# Altium project Vitrine.PrjPcb
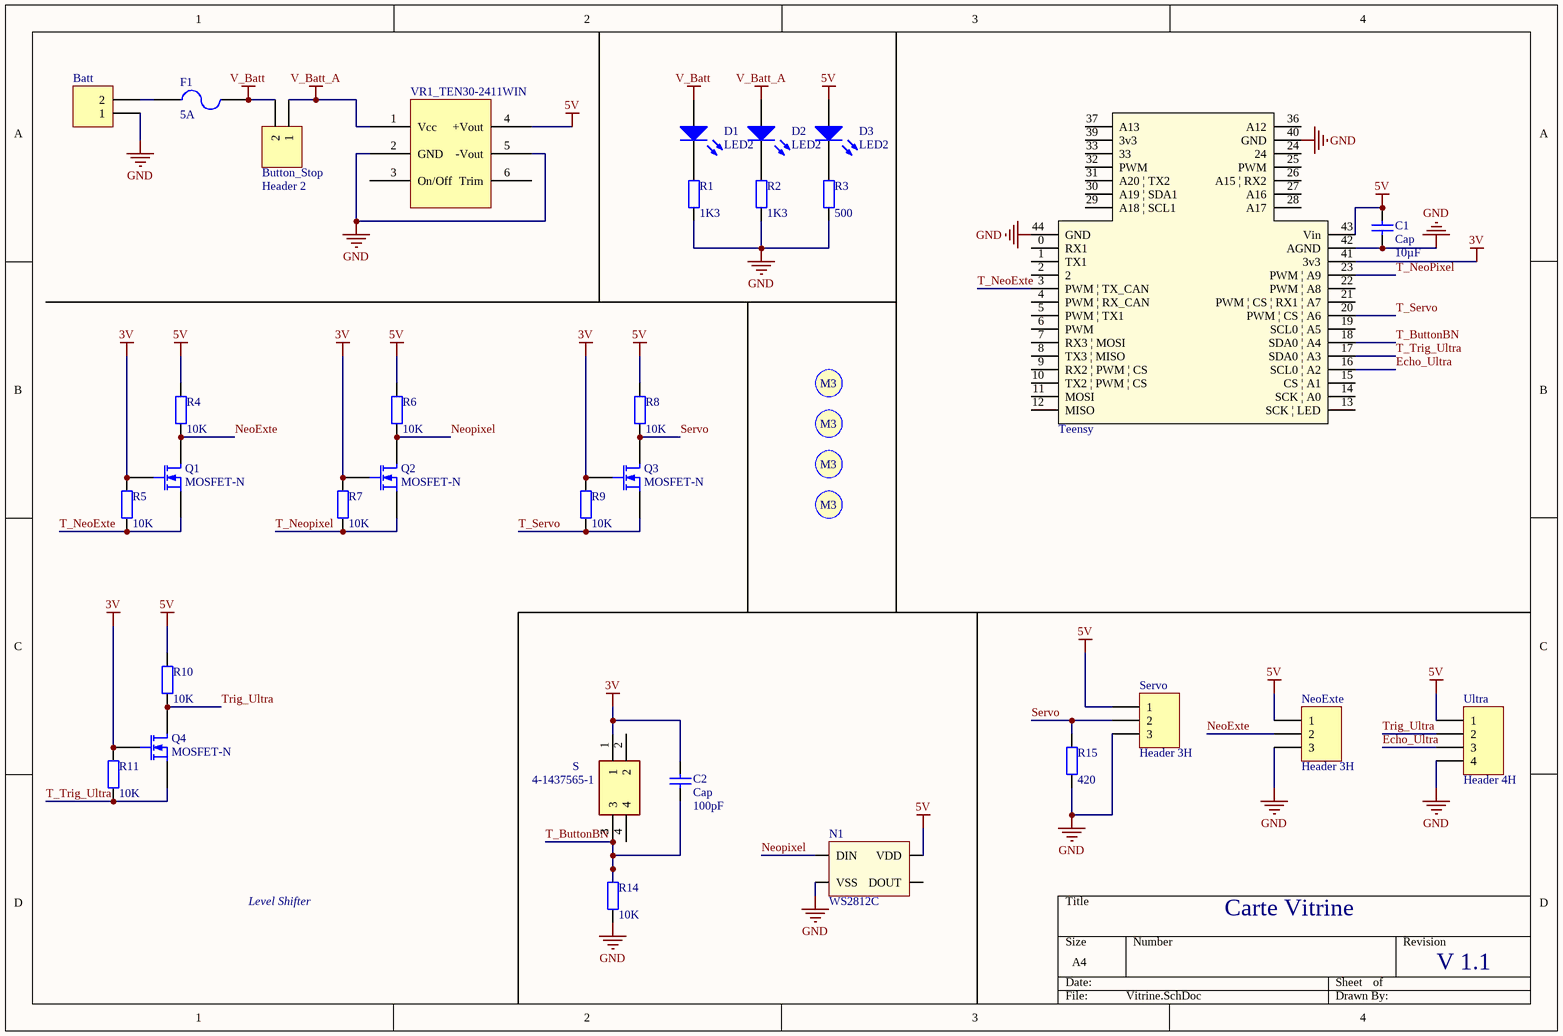
[diagram p0: Vitrine.SchDoc]
1 sheet, 36 parts. Net scope: global (net labels, ports and power ports of the same name join across sheets).
Board file: Vitrine.PcbDoc

## Sheet Vitrine.SchDoc
size A4

### Parts
Batt  (no value)  [Battery SALE]
Button_Stop  Header 2  [Molex_MiniFitJr_2x1H]
C1  Cap  value 10µF  [Capacitor 1206]
C2  Cap  value 100pF  [Capacitor 1206]
D1  LED2  [KP-3216SEC]
D2  LED2  [KP-3216SEC]
D3  LED2  [KP-3216SEC]
F1  5A  [Fuse]
N1  WS2812C  [Neopixel]
NeoExte  Header 3H  [S3B-XH-A]
Q1  MOSFET-N  [SOT23_M]
Q2  MOSFET-N  [SOT23_M]
Q3  MOSFET-N  [SOT23_M]
Q4  MOSFET-N  [SOT23_M]
R1  value 1K3  [Resistor 1206]
R2  value 1K3  [Resistor 1206]
R3  value 500  [Resistor 1206]
R4  value 10K  [Resistor 1206]
R5  value 10K  [Resistor 1206]
R6  value 10K  [Resistor 1206]
R7  value 10K  [Resistor 1206]
R8  value 10K  [Resistor 1206]
R9  value 10K  [Resistor 1206]
R10  value 10K  [Resistor 1206]
R11  value 10K  [Resistor 1206]
R14  value 10K  [Resistor 1206]
R15  value 420  [Resistor 1206]
S  4-1437565-1  [FSM-SWITCH]
S1  Screw M3  [Screw M3]  (value not drawn)  (mechanical)
S2  Screw M3  [Screw M3]  (value not drawn)  (mechanical)
S3  Screw M3  [Screw M3]  (value not drawn)  (mechanical)
S4  Screw M3  [Screw M3]  (value not drawn)  (mechanical)
Servo  Header 3H  [S3B-XH-A]
Teensy  Teensy 3.2  [Teensy_A_PMI]  (value not drawn)
Ultra  Header 4H  [S4B-XH-A]
VR1_TEN30-2411WIN  (no value)  [TRACO_2x1inch]

### Nets
3V: C2.2 Q1.2(G) Q2.2(G) Q3.2(G) Q4.2(G) R5.2 R7.2 R9.2 R11.2 S.1 Teensy.41(3v3)
5V: C1.2 D3.1(A) N1.4(VDD) NeoExte.1 R4.2 R6.2 R8.2 R10.2 Servo.1 Teensy.43(Vin) Ultra.1 VR1_TEN30-2411WIN.4(+Vout)
GND: Batt.1 C1.1 N1.2(VSS) NeoExte.3 R1.1 R2.1 R3.1 R14.1 R15.1 Servo.3 Teensy.40(GND) Teensy.42(AGND) Teensy.44(GND) Ultra.4 VR1_TEN30-2411WIN.2(GND) VR1_TEN30-2411WIN.5(-Vout)
V_Batt: Button_Stop.2 D1.1(A) F1.2
V_Batt_A: Button_Stop.1 D2.1(A) VR1_TEN30-2411WIN.1(Vcc)
Echo_Ultra: Teensy.16(SCL0_|_A2) Ultra.3
NeoExte: NeoExte.2 Q1.1(D) R4.1
Neopixel: N1.3(DIN) Q2.1(D) R6.1
Servo: Q3.1(D) R8.1 R15.2 Servo.2
T_ButtonBN: C2.1 R14.2 S.3 Teensy.18(SDA0_|_A4)
T_NeoExte: Q1.3(S) R5.1 Teensy.3(PWM_|_TX_CAN)
T_Neopixel: Q2.3(S) R7.1 Teensy.23(PWM_|_A9)
T_Servo: Q3.3(S) R9.1 Teensy.20(PWM_|_CS_|_A6)
T_Trig_Ultra: Q4.3(S) R11.1 Teensy.17(SDA0_|_A3)
Trig_Ultra: Q4.1(D) R10.1 Ultra.2
NetBatt_2: Batt.2 F1.1
NetD1_2: D1.2(K) R1.2
NetD2_2: D2.2(K) R2.2
NetD3_2: D3.2(K) R3.2

Not connected (* = marked no-connect by the designer): N1 1(DOUT); S 2 4; Teensy 0(RX1) 1(TX1) 2 4(PWM_|_RX_CAN) 5(PWM_|_TX1) 6(PWM) 7(RX3_|_MOSI) 8(TX3_|_MISO) 9(RX2_|_PWM_|_CS) 10(TX2_|_PWM_|_CS) 11(MOSI) 12(MISO) 13(SCK_|_LED) 14(SCK_|_A0) 15(CS_|_A1) 19(SCL0_|_A5) 21(PWM_|_CS_|_RX1_|_A7) 22(PWM_|_A8) 24 25(PWM) 26(A15_|_RX2) 27(A16) 28(A17) 29(A18_|_SCL1) 30(A19_|_SDA1) 31(A20_|_TX2) 32(PWM) 33 36(A12) 37(A13) 39(3v3); VR1_TEN30-2411WIN 3(On/Off) 6(Trim)

### Notes on the sheet
- Level Shifter
- Carte Vitrine
- V 1.1
- (in symbol Screw M3) M3

### Library data of the parts
Batt Button_Stop = Header 2: Header, 2-Pin; LatestRevisionDate: 17-Jul-2002; LatestRevisionNote: Re-released for DXP Platform.; Publisher: Altium Limited
C1 C2 = Cap: Capacitor; Published: 8-Jun-2000; LatestRevisionDate: 17-Jul-2002; LatestRevisionNote: Re-released for DXP Platform.; PackageReference: RAD-0.3; Publisher: Altium Limited; PackageDescription: Radial Cap, Thru-Hole; 2 Leads; 0.3 in Pin Spacing
D1-D3 = LED2: Typical RED, GREEN, YELLOW, AMBER GaAs LED; Published: 8-Jun-2000; LatestRevisionDate: 17-Jul-2002; LatestRevisionNote: Re-released for DXP Platform.; PackageVersion: Feb-2002; PackageReference: 3.2X1.6X1.1; Publisher: Altium Limited; PackageDescription: SM LED; 2 Flat Leads
F1 = Fuse 2: Fuse; Published: 8-Jun-2000; LatestRevisionDate: 17-Jul-2002; LatestRevisionNote: Re-released for DXP Platform.; PackageReference: PIN-W2/E2.8; Publisher: Altium Limited; PackageDescription: Thru-Hole; 2 Leads
N1 = NeoPixel: pin to pad: 1>2 2>3 3>4 4>1
NeoExte Servo = Header 3H: Header, 3-Pin, Right Angle; LatestRevisionDate: 17-Jul-2002; LatestRevisionNote: Re-released for DXP Platform.; Publisher: Altium Limited
Q1-Q4 = MOSFET-N: N-Channel MOSFET; Published: 8-Jun-2000; LatestRevisionDate: 17-Jul-2002; LatestRevisionNote: Re-released for DXP Platform.; PackageVersion: 1995/1996; PackageReference: E3; Publisher: Altium Limited; PackageDescription: TO, Flat Index; 3 In-Line, Axial Leads; Body Dia. 4.6mm; Lead Dia. 0.5 mm (max)
R1-R11 R14 R15 = Res2: Resistor; Published: 8-Jun-2000; LatestRevisionDate: 17-Jul-2002; LatestRevisionNote: Re-released for DXP Platform.; PackageReference: AXIAL-0.4; Publisher: Altium Limited; PackageDescription: Axial Device, Thru-Hole; 2 Leads; 0.4 in Pin Spacing
S = 4-1437565-1: Switch; Manufacturer_Name: TE Connectivity; Datasheet Link: http://docs-emea.rs-online.com/webdocs/14a3/0900766b814a3369.pdf; Manufacturer_Part_Number: 4-1437565-1; Arrow Part Number: 4-1437565-1; Arrow Price/Stock: https://www.arrow.com/en/products/4-1437565-1/te-connectivity; Mouser Part Number: N/A; Mouser Price/Stock: https://www.mouser.com/Search/Refine.aspx?Keyword=N%2FA
Teensy = teensy3.2_A_PMI
Ultra = Header 4H: Header, 4-Pin, Right Angle; LatestRevisionDate: 17-Jul-2002; LatestRevisionNote: Re-released for DXP Platform.; Publisher: Altium Limited
VR1_TEN30-2411WIN = TEN50: TRACO TEN50; LatestRevisionDate: 17-Jul-2002; LatestRevisionNote: Re-released for DXP Platform.; Publisher: Altium Limited